# EAGLE schematic design_main (EAGLE 9.6.2), part 1 of 2

## Sheet 1 of 4
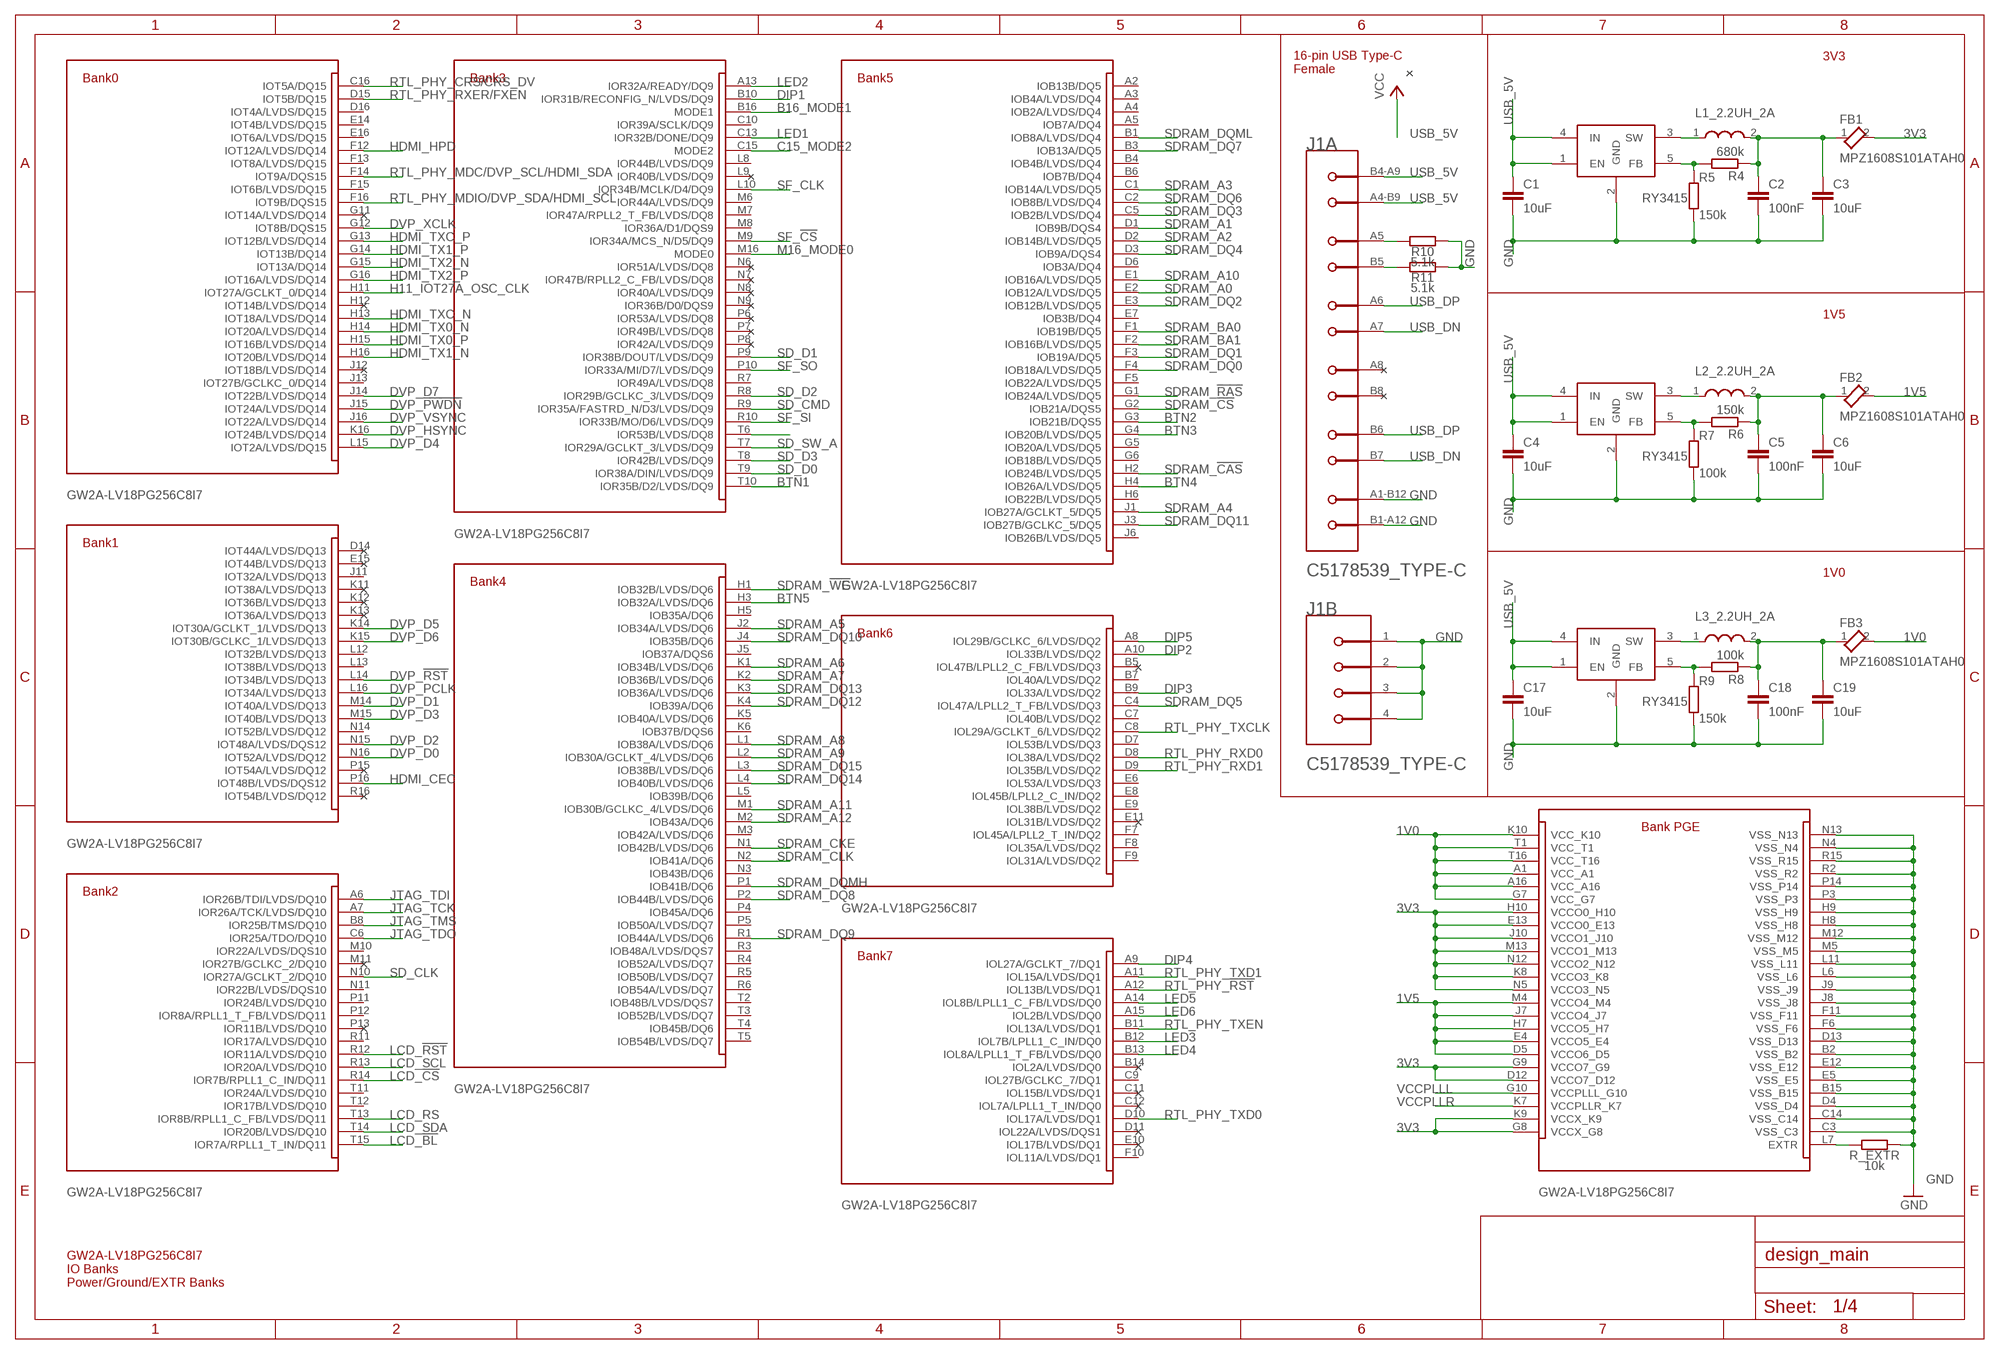
[diagram p0: schematic, sheet 1]

### Parts
C1  10uF  C-EUC0805  [C0805]
C2  100nF  C-EUC0805  [C0805]
C3  10uF  C-EUC0805  [C0805]
C4  10uF  C-EUC0805  [C0805]
C5  100nF  C-EUC0805  [C0805]
C6  10uF  C-EUC0805  [C0805]
C17  10uF  C-EUC0805  [C0805]
C18  100nF  C-EUC0805  [C0805]
C19  10uF  C-EUC0805  [C0805]
FB1  TDK_MPZ1608S101ATAH0TDK_MPZ1608S101ATAH0_0_0  [TDK_MPZ1608S101ATAH0_0]
FB2  TDK_MPZ1608S101ATAH0TDK_MPZ1608S101ATAH0_0_0  [TDK_MPZ1608S101ATAH0_0]
FB3  TDK_MPZ1608S101ATAH0TDK_MPZ1608S101ATAH0_0_0  [TDK_MPZ1608S101ATAH0_0]
J1  C5178539_TYPE-CMOLEX_217179-0001_0_0  [C5178539_TYPE-C]
L1_2.2UH_2A  L_0805TDK_MLZ2012N6R8LT000_0_0  [TDK_MLZ2012N6R8LT000_0]
L2_2.2UH_2A  2.2uH 2A  L_0805TDK_MLZ2012N6R8LT000_0_0  [TDK_MLZ2012N6R8LT000_0]
L3_2.2UH_2A  2.2uH 2A  L_0805TDK_MLZ2012N6R8LT000_0_0  [TDK_MLZ2012N6R8LT000_0]
R4  680k  R-EU_R0805  [R0805]
R5  150k  R-EU_R0805  [R0805]
R6  150k  R-EU_R0805  [R0805]
R7  100k  R-EU_R0805  [R0805]
R8  100k  R-EU_R0805  [R0805]
R9  150k  R-EU_R0805  [R0805]
R10  5.1k  R-EU_R0805  [R0805]
R11  5.1k  R-EU_R0805  [R0805]
R_EXTR  10k  R-EU_R0805  [R0805]
U$1  GW2A-LV18PG256C8I7  [BGA256C100P16X16_1700X1700X155]
U$3  RY3415  [RY3415]
U$4  RY3415  [RY3415]
U$5  RY3415  [RY3415]

### Nets
1V0: FB3.2 U$1.A1(VCC_A1) U$1.A16(VCC_A16) U$1.G7(VCC_G7) U$1.K10(VCC_K10) U$1.T1(VCC_T1) U$1.T16(VCC_T16) ; also sheet 2,4
1V5: FB2.2 U$1.D5(VCCO6_D5) U$1.E4(VCCO5_E4) U$1.H7(VCCO5_H7) U$1.J7(VCCO4_J7) U$1.M4(VCCO4_M4) ; also sheet 2,4
3V3: FB1.2 U$1.D12(VCCO7_D12) U$1.E13(VCCO0_E13) U$1.G8(VCCX_G8) U$1.G9(VCCO7_G9) U$1.H10(VCCO0_H10) U$1.J10(VCCO1_J10) U$1.K8(VCCO3_K8) U$1.K9(VCCX_K9) U$1.M13(VCCO1_M13) U$1.N5(VCCO3_N5) U$1.N12(VCCO2_N12) ; also sheet 2,3,4
B16_MODE1: U$1.B16(MODE1) ; also sheet 2
BTN1: U$1.T10(IOR35B/D2/LVDS/DQ9) ; also sheet 2
BTN2: U$1.G3(IOB21B/DQS5) ; also sheet 2
BTN3: U$1.G4(IOB20B/LVDS/DQ5) ; also sheet 2
BTN4: U$1.H4(IOB26A/LVDS/DQ5) ; also sheet 2
BTN5: U$1.H3(IOB32A/LVDS/DQ6) ; also sheet 2
C15_MODE2: U$1.C15(MODE2) ; also sheet 2
DIP1: U$1.B10(IOR31B/RECONFIG_N/LVDS/DQ9) ; also sheet 2
DIP2: U$1.A10(IOL33B/LVDS/DQ2) ; also sheet 2
DIP3: U$1.B9(IOL33A/LVDS/DQ2) ; also sheet 2
DIP4: U$1.A9(IOL27A/GCLKT_7/DQ1) ; also sheet 2
DIP5: U$1.A8(IOL29B/GCLKC_6/LVDS/DQ2) ; also sheet 2
DVP_!PWDN!: U$1.J15(IOT24A/LVDS/DQ14) ; also sheet 4
DVP_!RST!: U$1.L14(IOT34B/LVDS/DQ13) ; also sheet 4
DVP_D0: U$1.N16(IOT52A/LVDS/DQ12) ; also sheet 4
DVP_D1: U$1.M14(IOT40A/LVDS/DQ13) ; also sheet 4
DVP_D2: U$1.N15(IOT48A/LVDS/DQS12) ; also sheet 4
DVP_D3: U$1.M15(IOT40B/LVDS/DQ13) ; also sheet 4
DVP_D4: U$1.L15(IOT2A/LVDS/DQ15) ; also sheet 4
DVP_D5: U$1.K14(IOT30A/GCLKT_1/LVDS/DQ13) ; also sheet 4
DVP_D6: U$1.K15(IOT30B/GCLKC_1/LVDS/DQ13) ; also sheet 4
DVP_D7: U$1.J14(IOT22B/LVDS/DQ14) ; also sheet 4
DVP_HSYNC: U$1.K16(IOT24B/LVDS/DQ14) ; also sheet 4
DVP_PCLK: U$1.L16(IOT34A/LVDS/DQ13) ; also sheet 4
DVP_VSYNC: U$1.J16(IOT22A/LVDS/DQ14) ; also sheet 4
DVP_XCLK: U$1.G12(IOT8B/DQS15) ; also sheet 4
GND: C1.1 C2.1 C3.1 C4.1 C5.1 C6.1 C17.1 C18.1 C19.1 J1.1(B:MNT_1) J1.2(B:MNT_2) J1.3(B:MNT_3) J1.4(B:MNT_4) J1.A1-B12(A:1_GND) J1.B1-A12(A:2_GND) R5.2 R7.2 R9.2 R10.1 R11.1 R_EXTR.2 U$1.B2(VSS_B2) U$1.B15(VSS_B15) U$1.C3(VSS_C3) U$1.C14(VSS_C14) U$1.D4(VSS_D4) U$1.D13(VSS_D13) U$1.E5(VSS_E5) U$1.E12(VSS_E12) U$1.F6(VSS_F6) U$1.F11(VSS_F11) U$1.H8(VSS_H8) U$1.H9(VSS_H9) U$1.J8(VSS_J8) U$1.J9(VSS_J9) U$1.L6(VSS_L6) U$1.L11(VSS_L11) U$1.M5(VSS_M5) U$1.M12(VSS_M12) U$1.N4(VSS_N4) U$1.N13(VSS_N13) U$1.P3(VSS_P3) U$1.P14(VSS_P14) U$1.R2(VSS_R2) U$1.R15(VSS_R15) U$3.2(GND) U$4.2(GND) U$5.2(GND) ; also sheet 2,3,4
H11_IOT27A_OSC_CLK: U$1.H11(IOT27A/GCLKT_0/DQ14) ; also sheet 2
HDMI_CEC: U$1.P16(IOT48B/LVDS/DQS12) ; also sheet 4
HDMI_HPD: U$1.F12(IOT12A/LVDS/DQ14) ; also sheet 4
HDMI_TX0_N: U$1.H14(IOT20A/LVDS/DQ14) ; also sheet 4
HDMI_TX0_P: U$1.H15(IOT16B/LVDS/DQ14) ; also sheet 4
HDMI_TX1_N: U$1.H16(IOT20B/LVDS/DQ14) ; also sheet 4
HDMI_TX1_P: U$1.G14(IOT13B/DQ14) ; also sheet 4
HDMI_TX2_N: U$1.G15(IOT13A/DQ14) ; also sheet 4
HDMI_TX2_P: U$1.G16(IOT16A/LVDS/DQ14) ; also sheet 4
HDMI_TXC_N: U$1.H13(IOT18A/LVDS/DQ14) ; also sheet 4
HDMI_TXC_P: U$1.G13(IOT12B/LVDS/DQ14) ; also sheet 4
JTAG_TCK: U$1.A7(IOR26A/TCK/LVDS/DQ10) ; also sheet 2,4
JTAG_TDI: U$1.A6(IOR26B/TDI/LVDS/DQ10) ; also sheet 2,4
JTAG_TDO: U$1.C6(IOR25A/TDO/DQ10) ; also sheet 2,4
JTAG_TMS: U$1.B8(IOR25B/TMS/DQ10) ; also sheet 2,4
LCD_!BL!: U$1.T15(IOR7A/RPLL1_T_IN/DQ11) ; also sheet 3
LCD_!CS!: U$1.R14(IOR7B/RPLL1_C_IN/DQ11) ; also sheet 3
LCD_!RST!: U$1.R12(IOR11A/LVDS/DQ10) ; also sheet 3
LCD_RS: U$1.T13(IOR8B/RPLL1_C_FB/LVDS/DQ11) ; also sheet 3
LCD_SCL: U$1.R13(IOR20A/LVDS/DQ10) ; also sheet 3
LCD_SDA: U$1.T14(IOR20B/LVDS/DQ10) ; also sheet 3
LED1: U$1.C13(IOR32B/DONE/DQ9) ; also sheet 2
LED2: U$1.A13(IOR32A/READY/DQ9) ; also sheet 2
LED3: U$1.B12(IOL7B/LPLL1_C_IN/DQ0) ; also sheet 2
LED4: U$1.B13(IOL8A/LPLL1_T_FB/LVDS/DQ0) ; also sheet 2
LED5: U$1.A14(IOL8B/LPLL1_C_FB/LVDS/DQ0) ; also sheet 2
LED6: U$1.A15(IOL2B/LVDS/DQ0) ; also sheet 2
M16_MODE0: U$1.M16(MODE0) ; also sheet 2
N$1: R6.2 R7.1 U$4.5(FB)
N$2: R_EXTR.1 U$1.L7(EXTR)
N$4: U$1.T6(IOR53B/LVDS/DQ8)
N$5: L2_2.2UH_2A.1 U$4.3(SW)
N$42: C5.2 C6.2 FB2.1 L2_2.2UH_2A.2 R6.1
N$43: R4.2 R5.1 U$3.5(FB)
N$44: L1_2.2UH_2A.1 U$3.3(SW)
N$45: C2.2 C3.2 FB1.1 L1_2.2UH_2A.2 R4.1
N$46: R8.2 R9.1 U$5.5(FB)
N$47: L3_2.2UH_2A.1 U$5.3(SW)
N$48: C18.2 C19.2 FB3.1 L3_2.2UH_2A.2 R8.1
N$49: J1.A5(A:CC1) R10.2
N$50: J1.B5(A:CC2) R11.2
RTL_PHY_!RST!: U$1.A12(IOL13B/LVDS/DQ1) ; also sheet 3
RTL_PHY_CRS/CRS_DV: U$1.C16(IOT5A/DQ15) ; also sheet 3
RTL_PHY_MDC/DVP_SCL/HDMI_SDA: U$1.F14(IOT9A/DQS15) ; also sheet 3,4
RTL_PHY_MDIO/DVP_SDA/HDMI_SCL: U$1.F16(IOT9B/DQS15) ; also sheet 3,4
RTL_PHY_RXD0: U$1.D8(IOL38A/LVDS/DQ2) ; also sheet 3
RTL_PHY_RXD1: U$1.D9(IOL35B/LVDS/DQ2) ; also sheet 3
RTL_PHY_RXER/FXEN: U$1.D15(IOT5B/DQ15) ; also sheet 3
RTL_PHY_TXCLK: U$1.C8(IOL29A/GCLKT_6/LVDS/DQ2) ; also sheet 3
RTL_PHY_TXD0: U$1.D10(IOL17A/LVDS/DQ1) ; also sheet 3
RTL_PHY_TXD1: U$1.A11(IOL15A/LVDS/DQ1) ; also sheet 3
RTL_PHY_TXEN: U$1.B11(IOL13A/LVDS/DQ1) ; also sheet 3
SD_CLK: U$1.N10(IOR27A/GCLKT_2/DQ10) ; also sheet 2
SD_CMD: U$1.R9(IOR35A/FASTRD_N/D3/LVDS/DQ9) ; also sheet 2
SD_D0: U$1.T9(IOR38A/DIN/LVDS/DQ9) ; also sheet 2
SD_D1: U$1.P9(IOR38B/DOUT/LVDS/DQ9) ; also sheet 2
SD_D2: U$1.R8(IOR29B/GCLKC_3/LVDS/DQ9) ; also sheet 2
SD_D3: U$1.T8(IOR42B/LVDS/DQ9) ; also sheet 2
SD_SW_A: U$1.T7(IOR29A/GCLKT_3/LVDS/DQ9) ; also sheet 2
SDRAM_!CAS!: U$1.H2(IOB24B/LVDS/DQ5) ; also sheet 3
SDRAM_!CS!: U$1.G2(IOB21A/DQS5) ; also sheet 3
SDRAM_!RAS!: U$1.G1(IOB24A/LVDS/DQ5) ; also sheet 3
SDRAM_!WE!: U$1.H1(IOB32B/LVDS/DQ6) ; also sheet 3
SDRAM_A0: U$1.E2(IOB12A/LVDS/DQ5) ; also sheet 3
SDRAM_A1: U$1.D1(IOB9B/DQS4) ; also sheet 3
SDRAM_A2: U$1.D2(IOB14B/LVDS/DQ5) ; also sheet 3
SDRAM_A3: U$1.C1(IOB14A/LVDS/DQ5) ; also sheet 3
SDRAM_A4: U$1.J1(IOB27A/GCLKT_5/DQ5) ; also sheet 3
SDRAM_A5: U$1.J2(IOB34A/LVDS/DQ6) ; also sheet 3
SDRAM_A6: U$1.K1(IOB34B/LVDS/DQ6) ; also sheet 3
SDRAM_A7: U$1.K2(IOB36B/LVDS/DQ6) ; also sheet 3
SDRAM_A8: U$1.L1(IOB38A/LVDS/DQ6) ; also sheet 3
SDRAM_A9: U$1.L2(IOB30A/GCLKT_4/LVDS/DQ6) ; also sheet 3
SDRAM_A10: U$1.E1(IOB16A/LVDS/DQ5) ; also sheet 3
SDRAM_A11: U$1.M1(IOB30B/GCLKC_4/LVDS/DQ6) ; also sheet 3
SDRAM_A12: U$1.M2(IOB43A/DQ6) ; also sheet 3
SDRAM_BA0: U$1.F1(IOB19B/DQ5) ; also sheet 3
SDRAM_BA1: U$1.F2(IOB16B/LVDS/DQ5) ; also sheet 3
SDRAM_CKE: U$1.N1(IOB42B/LVDS/DQ6) ; also sheet 3
SDRAM_CLK: U$1.N2(IOB41A/DQ6) ; also sheet 3
SDRAM_DQ0: U$1.F4(IOB18A/LVDS/DQ5) ; also sheet 3
SDRAM_DQ1: U$1.F3(IOB19A/DQ5) ; also sheet 3
SDRAM_DQ2: U$1.E3(IOB12B/LVDS/DQ5) ; also sheet 3
SDRAM_DQ3: U$1.C5(IOB2B/LVDS/DQ4) ; also sheet 3
SDRAM_DQ4: U$1.D3(IOB9A/DQS4) ; also sheet 3
SDRAM_DQ5: U$1.C4(IOL47A/LPLL2_T_FB/LVDS/DQ3) ; also sheet 3
SDRAM_DQ6: U$1.C2(IOB8B/LVDS/DQ4) ; also sheet 3
SDRAM_DQ7: U$1.B3(IOB13A/DQ5) ; also sheet 3
SDRAM_DQ8: U$1.P2(IOB44B/LVDS/DQ6) ; also sheet 3
SDRAM_DQ9: U$1.R1(IOB44A/LVDS/DQ6) ; also sheet 3
SDRAM_DQ10: U$1.J4(IOB35B/DQ6) ; also sheet 3
SDRAM_DQ11: U$1.J3(IOB27B/GCLKC_5/DQ5) ; also sheet 3
SDRAM_DQ12: U$1.K4(IOB39A/DQ6) ; also sheet 3
SDRAM_DQ13: U$1.K3(IOB36A/LVDS/DQ6) ; also sheet 3
SDRAM_DQ14: U$1.L4(IOB40B/LVDS/DQ6) ; also sheet 3
SDRAM_DQ15: U$1.L3(IOB38B/LVDS/DQ6) ; also sheet 3
SDRAM_DQMH: U$1.P1(IOB41B/DQ6) ; also sheet 3
SDRAM_DQML: U$1.B1(IOB8A/LVDS/DQ4) ; also sheet 3
SF_!CS!: U$1.M9(IOR34A/MCS_N/D5/DQ9) ; also sheet 3
SF_CLK: U$1.L10(IOR34B/MCLK/D4/DQ9) ; also sheet 3
SF_SI: U$1.R10(IOR33B/MO/D6/LVDS/DQ9) ; also sheet 3
SF_SO: U$1.P10(IOR33A/MI/D7/LVDS/DQ9) ; also sheet 3
USB_5V: C1.2 C4.2 C17.2 J1.A4-B9(A:1_VBUS) J1.B4-A9(A:2_VBUS) U$3.1(EN) U$3.4(IN) U$4.1(EN) U$4.4(IN) U$5.1(EN) U$5.4(IN) ; supply symbol labelled VCC ; also sheet 2,4
USB_DN: J1.A7(A:DN1) J1.B7(A:DN2) ; also sheet 2
USB_DP: J1.A6(A:DP1) J1.B6(A:DP2) ; also sheet 2
VCCPLLL: U$1.G10(VCCPLLL_G10) ; also sheet 2
VCCPLLR: U$1.K7(VCCPLLR_K7) ; also sheet 2
Unconnected: J1.A8(A:SBU1) J1.B8(A:SBU2) U$1.A2(IOB13B/DQ5) U$1.A3(IOB4A/LVDS/DQ4) U$1.A4(IOB2A/LVDS/DQ4) U$1.A5(IOB7A/DQ4) U$1.B4(IOB4B/LVDS/DQ4) U$1.B5(IOL47B/LPLL2_C_FB/LVDS/DQ3) U$1.B6(IOB7B/DQ4) U$1.B7(IOL40A/LVDS/DQ2) U$1.B14(IOL2A/LVDS/DQ0) U$1.C7(IOL40B/LVDS/DQ2) U$1.C9(IOL27B/GCLKC_7/DQ1) U$1.C10(IOR39A/SCLK/DQ9) U$1.C11(IOL15B/LVDS/DQ1) U$1.C12(IOL7A/LPLL1_T_IN/DQ0) U$1.D6(IOB3A/DQ4) U$1.D7(IOL53B/LVDS/DQ3) U$1.D11(IOL22A/LVDS/DQS1) U$1.D14(IOT44A/LVDS/DQ13) U$1.D16(IOT4A/LVDS/DQ15) U$1.E6(IOL53A/LVDS/DQ3) U$1.E7(IOB3B/DQ4) U$1.E8(IOL45B/LPLL2_C_IN/DQ2) U$1.E9(IOL38B/LVDS/DQ2) U$1.E10(IOL17B/LVDS/DQ1) U$1.E11(IOL31B/LVDS/DQ2) U$1.E14(IOT4B/LVDS/DQ15) U$1.E15(IOT44B/LVDS/DQ13) U$1.E16(IOT6A/LVDS/DQ15) U$1.F5(IOB22A/LVDS/DQ5) U$1.F7(IOL45A/LPLL2_T_IN/DQ2) U$1.F8(IOL35A/LVDS/DQ2) U$1.F9(IOL31A/LVDS/DQ2) U$1.F10(IOL11A/LVDS/DQ1) U$1.F13(IOT8A/LVDS/DQ15) U$1.F15(IOT6B/LVDS/DQ15) U$1.G5(IOB20A/LVDS/DQ5) U$1.G6(IOB18B/LVDS/DQ5) U$1.G11(IOT14A/LVDS/DQ14) U$1.H5(IOB35A/DQ6) U$1.H6(IOB22B/LVDS/DQ5) U$1.H12(IOT14B/LVDS/DQ14) U$1.J5(IOB37A/DQS6) U$1.J6(IOB26B/LVDS/DQ5) U$1.J11(IOT32A/LVDS/DQ13) U$1.J12(IOT18B/LVDS/DQ14) U$1.J13(IOT27B/GCLKC_0/DQ14) U$1.K5(IOB40A/LVDS/DQ6) U$1.K6(IOB37B/DQS6) U$1.K11(IOT38A/LVDS/DQ13) U$1.K12(IOT36B/LVDS/DQ13) U$1.K13(IOT36A/LVDS/DQ13) U$1.L5(IOB39B/DQ6) U$1.L8(IOR44B/LVDS/DQ9) U$1.L9(IOR40B/LVDS/DQ9) U$1.L12(IOT32B/LVDS/DQ13) U$1.L13(IOT38B/LVDS/DQ13) U$1.M3(IOB42A/LVDS/DQ6) U$1.M6(IOR44A/LVDS/DQ9) U$1.M7(IOR47A/RPLL2_T_FB/LVDS/DQ8) U$1.M8(IOR36A/D1/DQS9) U$1.M10(IOR22A/LVDS/DQS10) U$1.M11(IOR27B/GCLKC_2/DQ10) U$1.N3(IOB43B/DQ6) U$1.N6(IOR51A/LVDS/DQ8) U$1.N7(IOR47B/RPLL2_C_FB/LVDS/DQ8) U$1.N8(IOR40A/LVDS/DQ9) U$1.N9(IOR36B/D0/DQS9) U$1.N11(IOR22B/LVDS/DQS10) U$1.N14(IOT52B/LVDS/DQ12) U$1.P4(IOB45A/DQ6) U$1.P5(IOB50A/LVDS/DQ7) U$1.P6(IOR53A/LVDS/DQ8) U$1.P7(IOR49B/LVDS/DQ8) U$1.P8(IOR42A/LVDS/DQ9) U$1.P11(IOR24B/LVDS/DQ10) U$1.P12(IOR8A/RPLL1_T_FB/LVDS/DQ11) U$1.P13(IOR11B/LVDS/DQ10) U$1.P15(IOT54A/LVDS/DQ12) U$1.R3(IOB48A/LVDS/DQS7) U$1.R4(IOB52A/LVDS/DQ7) U$1.R5(IOB50B/LVDS/DQ7) U$1.R6(IOB54A/LVDS/DQ7) U$1.R7(IOR49A/LVDS/DQ8) U$1.R11(IOR17A/LVDS/DQ10) U$1.R16(IOT54B/LVDS/DQ12) U$1.T2(IOB48B/LVDS/DQS7) U$1.T3(IOB52B/LVDS/DQ7) U$1.T4(IOB45B/DQ6) U$1.T5(IOB54B/LVDS/DQ7) U$1.T11(IOR24A/LVDS/DQ10) U$1.T12(IOR17B/LVDS/DQ10)

### Notes on the sheet
- 3V3
- 16-pin USB Type-C
  Female
- 1V5
- 1V0
- GW2A-LV18PG256C8I7
  IO Banks
  Power/Ground/EXTR Banks

## Sheet 2 of 4
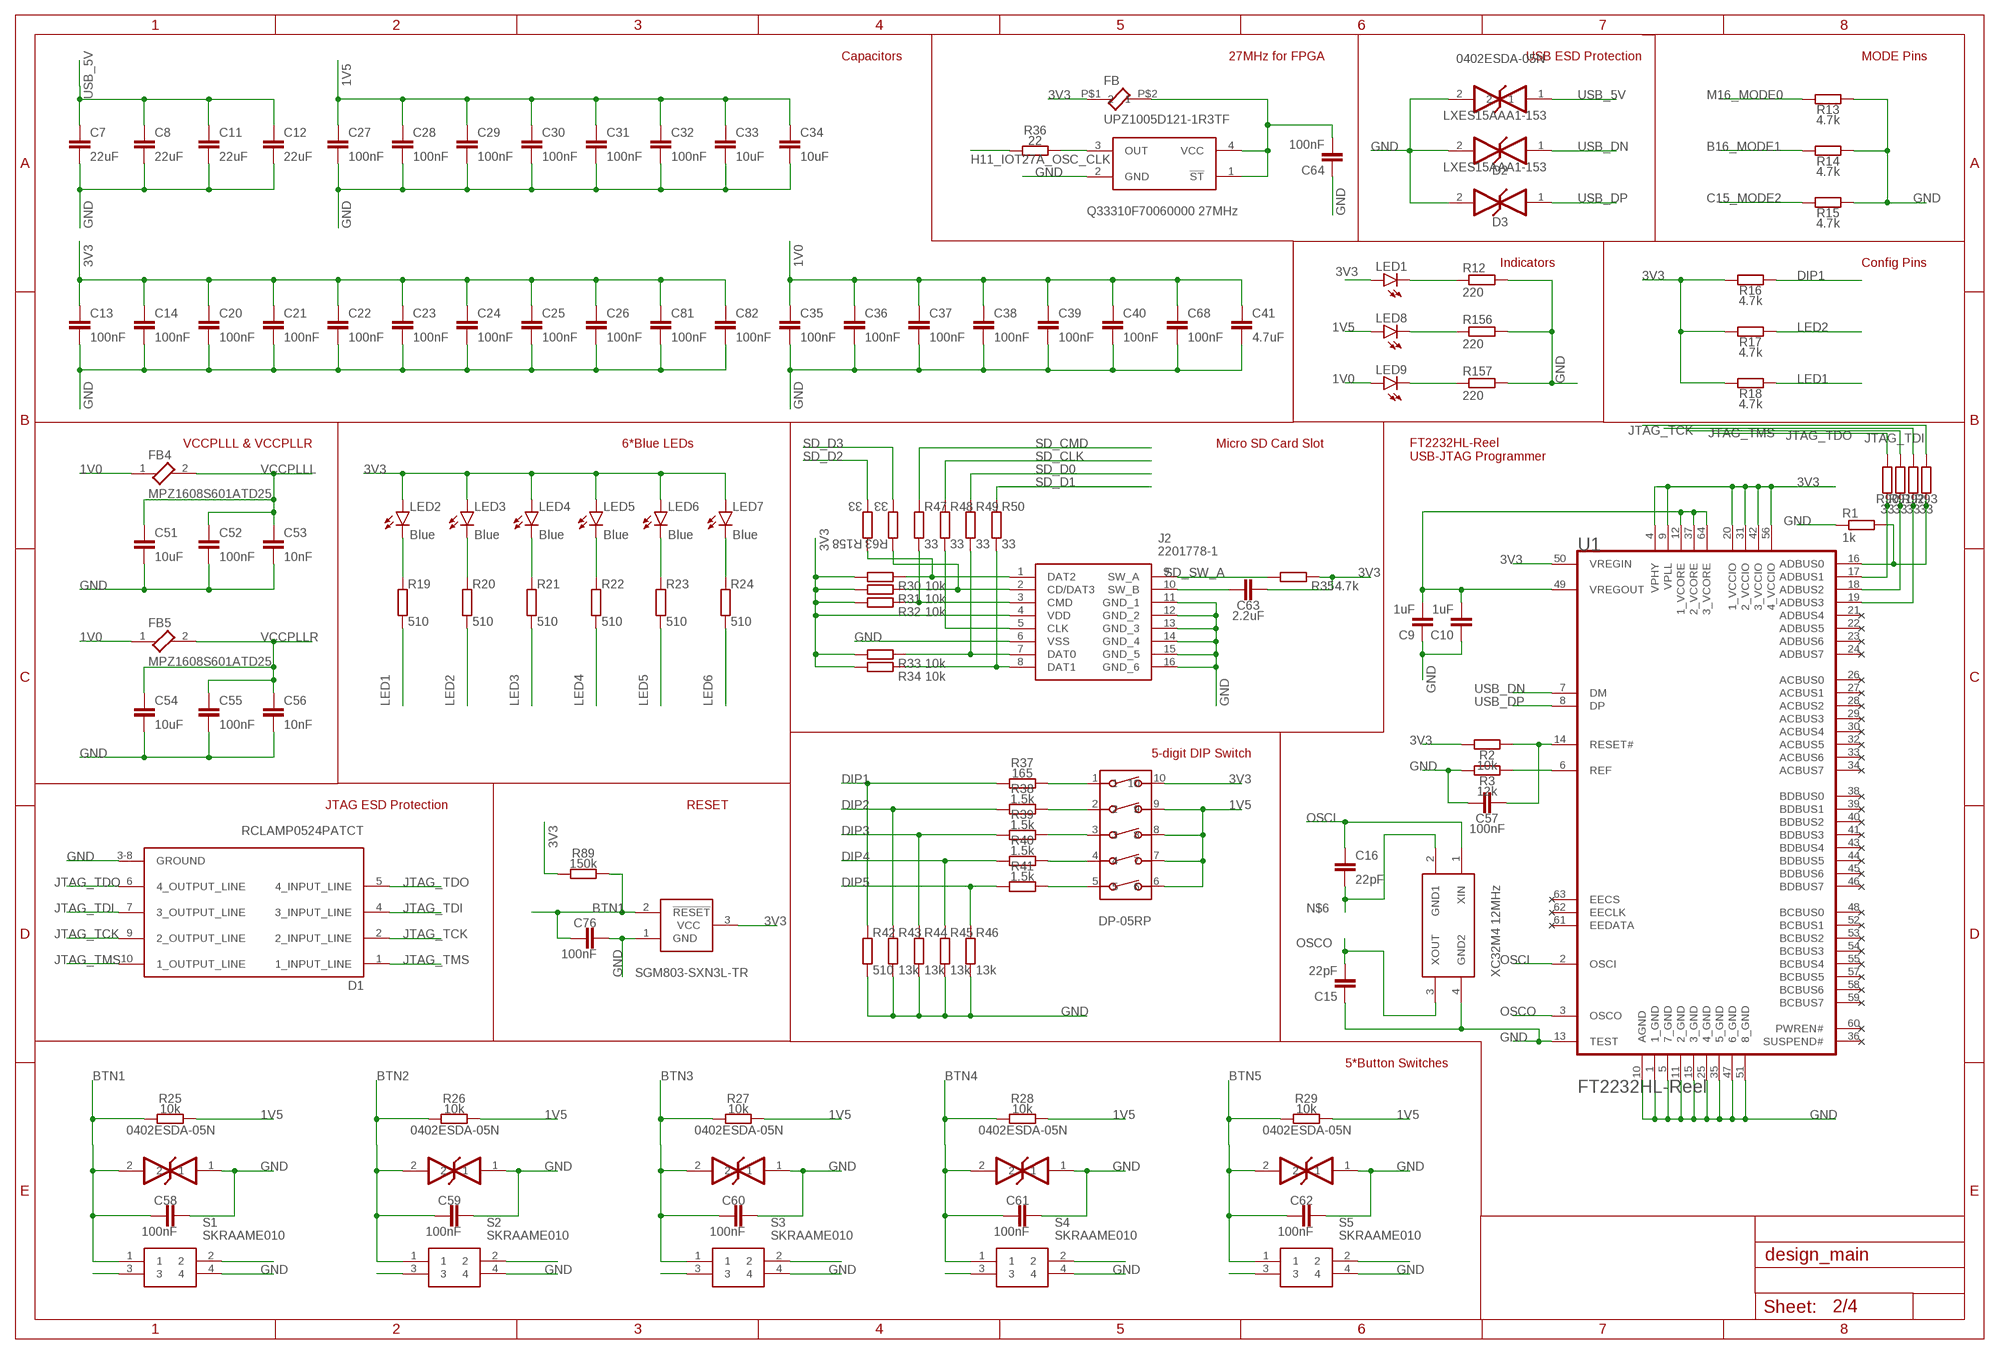
[diagram p1: schematic, sheet 2]

### Parts
C7  22uF  C-EUC0805  [C0805]
C8  22uF  C-EUC0805  [C0805]
C9  1uF  C-EUC0805  [C0805]
C10  1uF  C-EUC0805  [C0805]
C11  22uF  C-EUC0805  [C0805]
C12  22uF  C-EUC0805  [C0805]
C13  100nF  C-EUC0805  [C0805]
C14  100nF  C-EUC0805  [C0805]
C15  22pF  C-EUC0805  [C0805]
C16  22pF  C-EUC0805  [C0805]
C20  100nF  C-EUC0805  [C0805]
C21  100nF  C-EUC0805  [C0805]
C22  100nF  C-EUC0805  [C0805]
C23  100nF  C-EUC0805  [C0805]
C24  100nF  C-EUC0805  [C0805]
C25  100nF  C-EUC0805  [C0805]
C26  100nF  C-EUC0805  [C0805]
C27  100nF  C-EUC0805  [C0805]
C28  100nF  C-EUC0805  [C0805]
C29  100nF  C-EUC0805  [C0805]
C30  100nF  C-EUC0805  [C0805]
C31  100nF  C-EUC0805  [C0805]
C32  100nF  C-EUC0805  [C0805]
C33  10uF  C-EUC0805  [C0805]
C34  10uF  C-EUC0805  [C0805]
C35  100nF  C-EUC0805  [C0805]
C36  100nF  C-EUC0805  [C0805]
C37  100nF  C-EUC0805  [C0805]
C38  100nF  C-EUC0805  [C0805]
C39  100nF  C-EUC0805  [C0805]
C40  100nF  C-EUC0805  [C0805]
C41  4.7uF  C-EUC0805  [C0805]
C51  10uF  C-EUC0805  [C0805]
C52  100nF  C-EUC0805  [C0805]
C53  10nF  C-EUC0805  [C0805]
C54  10uF  C-EUC0805  [C0805]
C55  100nF  C-EUC0805  [C0805]
C56  10nF  C-EUC0805  [C0805]
C57  100nF  C-EUC0805  [C0805]
C58  100nF  C-EUC0805  [C0805]
C59  100nF  C-EUC0805  [C0805]
C60  100nF  C-EUC0805  [C0805]
C61  100nF  C-EUC0805  [C0805]
C62  100nF  C-EUC0805  [C0805]
C63  2.2uF  C-EUC0805  [C0805]
C64  100nF  C-EUC0805  [C0805]
C68  100nF  C-EUC0805  [C0805]
C76  100nF  C-EUC0805  [C0805]
C81  100nF  C-EUC0805  [C0805]
C82  100nF  C-EUC0805  [C0805]
D1  SEMTECH_RCLAMP0524PATCTSEMTECH_RCLAMP0524PATCT_0_0  [SEMTECH_RCLAMP0524PATCT_0]
D2  MURATA_LXES15AAA1-153MURATA_LXES15AAA1-153_0_0  [MURATA_LXES15AAA1-153_0]
D3  MURATA_LXES15AAA1-153MURATA_LXES15AAA1-153_0_0  [MURATA_LXES15AAA1-153_0]
FB  UPZ1005D121-1R3TF  [UPZ1005D121-1R3TF]
FB4  TDK_MPZ1608S601ATD25TDK_MPZ1608S601ATD25_0_0  [TDK_MPZ1608S601ATD25_0]
FB5  TDK_MPZ1608S601ATD25TDK_MPZ1608S601ATD25_0_0  [TDK_MPZ1608S601ATD25_0]
J2  2201778-1  [22017781]
LED1  LEDSML0805  [SML0805]
LED2  Blue  LEDSML0805  [SML0805]
LED3  Blue  LEDSML0805  [SML0805]
LED4  Blue  LEDSML0805  [SML0805]
LED5  Blue  LEDSML0805  [SML0805]
LED6  Blue  LEDSML0805  [SML0805]
LED7  Blue  LEDSML0805  [SML0805]
LED8  LEDSML0805  [SML0805]
LED9  LEDSML0805  [SML0805]
R1  1k  R-EU_R0805  [R0805]
R2  10k  R-EU_R0805  [R0805]
R3  12k  R-EU_R0805  [R0805]
R12  220  R-EU_R0805  [R0805]
R13  4.7k  R-EU_R0805  [R0805]
R14  4.7k  R-EU_R0805  [R0805]
R15  4.7k  R-EU_R0805  [R0805]
R16  4.7k  R-EU_R0805  [R0805]
R17  4.7k  R-EU_R0805  [R0805]
R18  4.7k  R-EU_R0805  [R0805]
R19  510  R-EU_R0805  [R0805]
R20  510  R-EU_R0805  [R0805]
R21  510  R-EU_R0805  [R0805]
R22  510  R-EU_R0805  [R0805]
R23  510  R-EU_R0805  [R0805]
R24  510  R-EU_R0805  [R0805]
R25  10k  R-EU_R0805  [R0805]
R26  10k  R-EU_R0805  [R0805]
R27  10k  R-EU_R0805  [R0805]
R28  10k  R-EU_R0805  [R0805]
R29  10k  R-EU_R0805  [R0805]
R30  10k  R-EU_R0805  [R0805]
R31  10k  R-EU_R0805  [R0805]
R32  10k  R-EU_R0805  [R0805]
R33  10k  R-EU_R0805  [R0805]
R34  10k  R-EU_R0805  [R0805]
R35  4.7k  R-EU_R0805  [R0805]
R36  22  R-EU_R0805  [R0805]
R37  165  R-EU_R0805  [R0805]
R38  1.5k  R-EU_R0805  [R0805]
R39  1.5k  R-EU_R0805  [R0805]
R40  1.5k  R-EU_R0805  [R0805]
R41  1.5k  R-EU_R0805  [R0805]
R42  510  R-EU_R0805  [R0805]
R43  13k  R-EU_R0805  [R0805]
R44  13k  R-EU_R0805  [R0805]
R45  13k  R-EU_R0805  [R0805]
R46  13k  R-EU_R0805  [R0805]
R47  33  R-EU_R0805  [R0805]
R48  33  R-EU_R0805  [R0805]
R49  33  R-EU_R0805  [R0805]
R50  33  R-EU_R0805  [R0805]
R63  33  R-EU_R0805  [R0805]
R89  150k  R-EU_R0805  [R0805]
R90  33  R-EU_R0805  [R0805]
R91  33  R-EU_R0805  [R0805]
R92  33  R-EU_R0805  [R0805]
R93  33  R-EU_R0805  [R0805]
R156  220  R-EU_R0805  [R0805]
R157  220  R-EU_R0805  [R0805]
R158  33  R-EU_R0805  [R0805]
S1  SKRAAME010  [SKRAAME010]
S2  SKRAAME010  [SKRAAME010]
S3  SKRAAME010  [SKRAAME010]
S4  SKRAAME010  [SKRAAME010]
S5  SKRAAME010  [SKRAAME010]
U1  FTDI_FT2232HL-REELFTDI_FT2232HL-REEL_0_0  [FTDI_FT2232HL-REEL_0]
U$2  XC32M4-12MHZ  [XC32M4-12MHZ]
U$6  0402ESDA-05N  [0402ESDA-05N]
U$7  0402ESDA-05N  [0402ESDA-05N]
U$8  0402ESDA-05N  [0402ESDA-05N]
U$9  0402ESDA-05N  [0402ESDA-05N]
U$10  0402ESDA-05N  [0402ESDA-05N]
U$11  0402ESDA-05N  [0402ESDA-05N]
U$13  DP-05RP  [DP-05RP]
U$15  Q33310F70060000-27MHZ  [Q33310F70060000-27MHZ]
U$16  SGM803-SXN3L-TR  [SGM803-SXN3L-TR]

### Nets
1V0: C35.2 C36.2 C37.2 C38.2 C39.2 C40.2 C41.2 C68.2 FB4.1 FB5.1 LED9.A ; also sheet 1,4
1V5: C27.2 C28.2 C29.2 C30.2 C31.2 C32.2 C33.2 C34.2 LED8.A R25.2 R26.2 R27.2 R28.2 R29.2 U$13.6 U$13.7 U$13.8 U$13.9 ; also sheet 1,4
3V3: C13.2 C14.2 C20.2 C21.2 C22.2 C23.2 C24.2 C25.2 C26.2 C63.1 C81.2 C82.2 FB.P$1 J2.4(VDD) LED1.A LED2.A LED3.A LED4.A LED5.A LED6.A LED7.A R2.1 R16.2 R17.2 R18.2 R30.1 R31.1 R32.1 R33.1 R34.1 R35.2 R89.1 U1.4(VPHY) U1.9(VPLL) U1.20(1_VCCIO) U1.31(2_VCCIO) U1.42(3_VCCIO) U1.50(VREGIN) U1.56(4_VCCIO) U$13.10 U$16.3(VCC) ; also sheet 1,3,4
B16_MODE1: R14.2 ; also sheet 1
BTN1: C58.2 C76.2 R25.1 R89.2 S1.1 U$7.2 U$16.2(!RESET!) ; also sheet 1
BTN2: C59.2 R26.1 S2.1 U$8.2 ; also sheet 1
BTN3: C60.2 R27.1 S3.1 U$9.2 ; also sheet 1
BTN4: C61.2 R28.1 S4.1 U$10.2 ; also sheet 1
BTN5: C62.2 R29.1 S5.1 U$11.2 ; also sheet 1
C15_MODE2: R15.2 ; also sheet 1
DIP1: R16.1 R37.1 R42.2 ; also sheet 1
DIP2: R38.1 R43.2 ; also sheet 1
DIP3: R39.1 R44.2 ; also sheet 1
DIP4: R40.1 R45.2 ; also sheet 1
DIP5: R41.1 R46.2 ; also sheet 1
GND: C7.1 C8.1 C9.1 C10.1 C11.1 C12.1 C13.1 C14.1 C15.1 C20.1 C21.1 C22.1 C23.1 C24.1 C25.1 C26.1 C27.1 C28.1 C29.1 C30.1 C31.1 C32.1 C33.1 C34.1 C35.1 C36.1 C37.1 C38.1 C39.1 C40.1 C41.1 C51.1 C52.1 C53.1 C54.1 C55.1 C56.1 C57.2 C58.1 C59.1 C60.1 C61.1 C62.1 C64.1 C68.1 C76.1 C81.1 C82.1 D1.3-8(GROUND) D2.2 D3.2 J2.6(VSS) J2.11(GND_1) J2.12(GND_2) J2.13(GND_3) J2.14(GND_4) J2.15(GND_5) J2.16(GND_6) R1.1 R3.1 R12.2 R13.1 R14.1 R15.1 R42.1 R43.1 R44.1 R45.1 R46.1 R156.2 R157.2 S1.4 S2.4 S3.4 S4.4 S5.4 U1.1(1_GND) U1.5(7_GND) U1.10(AGND) U1.11(2_GND) U1.13(TEST) U1.15(3_GND) U1.25(4_GND) U1.35(5_GND) U1.47(6_GND) U1.51(8_GND) U$2.4(GND2) U$6.2 U$7.1 U$8.1 U$9.1 U$10.1 U$11.1 U$15.2(GND) U$16.1(GND) ; also sheet 1,3,4
H11_IOT27A_OSC_CLK: R36.2 ; also sheet 1
JTAG_TCK: D1.2(2_INPUT_LINE) D1.9(2_OUTPUT_LINE) R93.1 ; also sheet 1,4
JTAG_TDI: D1.4(3_INPUT_LINE) D1.7(3_OUTPUT_LINE) R90.1 ; also sheet 1,4
JTAG_TDO: D1.5(4_INPUT_LINE) D1.6(4_OUTPUT_LINE) R91.1 ; also sheet 1,4
JTAG_TMS: D1.1(1_INPUT_LINE) D1.10(1_OUTPUT_LINE) R92.1 ; also sheet 1,4
LED1: R18.1 R19.2 ; also sheet 1
LED2: R17.1 R20.2 ; also sheet 1
LED3: R21.2 ; also sheet 1
LED4: R22.2 ; also sheet 1
LED5: R23.2 ; also sheet 1
LED6: R24.2 ; also sheet 1
M16_MODE0: R13.2 ; also sheet 1
N$3: R39.2 U$13.3
N$6: C16.1 U$2.2(GND1)
N$37: R3.2 U1.6(REF)
N$38: C57.1 R2.2 U1.14(RESET#)
N$39: C63.2 J2.10(SW_B)
N$41: J2.2(CD/DAT3) R31.2 R63.1
N$51: C9.2 C10.2 U1.12(1_VCORE) U1.37(2_VCORE) U1.49(VREGOUT) U1.64(3_VCORE)
N$52: LED1.C R12.1
N$56: J2.3(CMD) R32.2 R47.2
N$57: LED2.C R19.1
N$58: LED3.C R20.1
N$59: LED4.C R21.1
N$60: LED5.C R22.1
N$61: LED6.C R23.1
N$62: LED7.C R24.1
N$64: S1.3
N$65: S1.2
N$66: C64.2 FB.P$2 U$15.1(!ST!) U$15.4(VCC)
N$67: S2.3
N$68: S2.2
N$69: R36.1 U$15.3(OUT)
N$70: S3.3
N$71: S3.2
N$72: R37.2 U$13.1
N$73: S4.3
N$74: S4.2
N$75: R38.2 U$13.2
N$76: S5.3
N$77: S5.2
N$79: R40.2 U$13.4
N$80: R41.2 U$13.5
N$81: J2.5(CLK) R48.2
N$82: J2.7(DAT0) R33.2 R49.2
N$83: J2.8(DAT1) R34.2 R50.2
N$95: J2.1(DAT2) R30.2 R158.1
N$127: R1.2 R93.2 U1.16(ADBUS0)
N$128: R90.2 U1.17(ADBUS1)
N$129: R91.2 U1.18(ADBUS2)
N$130: R92.2 U1.19(ADBUS3)
N$183: LED8.C R156.1
N$189: LED9.C R157.1
OSCI: C16.2 U1.2(OSCI) U$2.1(XIN)
OSCO: C15.2 U1.3(OSCO) U$2.3(XOUT)
SD_CLK: R48.1 ; also sheet 1
SD_CMD: R47.1 ; also sheet 1
SD_D0: R49.1 ; also sheet 1
SD_D1: R50.1 ; also sheet 1
SD_D2: R158.2 ; also sheet 1
SD_D3: R63.2 ; also sheet 1
SD_SW_A: J2.9(SW_A) R35.1 ; also sheet 1
USB_5V: C7.2 C8.2 C11.2 C12.2 U$6.1 ; also sheet 1,4
USB_DN: D2.1 U1.7(DM) ; also sheet 1
USB_DP: D3.1 U1.8(DP) ; also sheet 1
VCCPLLL: C51.2 C52.2 C53.2 FB4.2 ; also sheet 1
VCCPLLR: C54.2 C55.2 C56.2 FB5.2 ; also sheet 1
Unconnected: U1.21(ADBUS4) U1.22(ADBUS5) U1.23(ADBUS6) U1.24(ADBUS7) U1.26(ACBUS0) U1.27(ACBUS1) U1.28(ACBUS2) U1.29(ACBUS3) U1.30(ACBUS4) U1.32(ACBUS5) U1.33(ACBUS6) U1.34(ACBUS7) U1.36(SUSPEND#) U1.38(BDBUS0) U1.39(BDBUS1) U1.40(BDBUS2) U1.41(BDBUS3) U1.43(BDBUS4) U1.44(BDBUS5) U1.45(BDBUS6) U1.46(BDBUS7) U1.48(BCBUS0) U1.52(BCBUS1) U1.53(BCBUS2) U1.54(BCBUS3) U1.55(BCBUS4) U1.57(BCBUS5) U1.58(BCBUS6) U1.59(BCBUS7) U1.60(PWREN#) U1.61(EEDATA) U1.62(EECLK) U1.63(EECS)

### Notes on the sheet
- Capacitors | 27MHz for FPGA | USB ESD Protection | MODE Pins
- Indicators | Config Pins
- VCCPLLL & VCCPLLR | 6*Blue LEDs | Micro SD Card Slot
- FT2232HL-Reel 
  USB-JTAG Programmer
- 5-digit DIP Switch
- JTAG ESD Protection | RESET
- 5*Button Switches

## Sheet 3 of 4
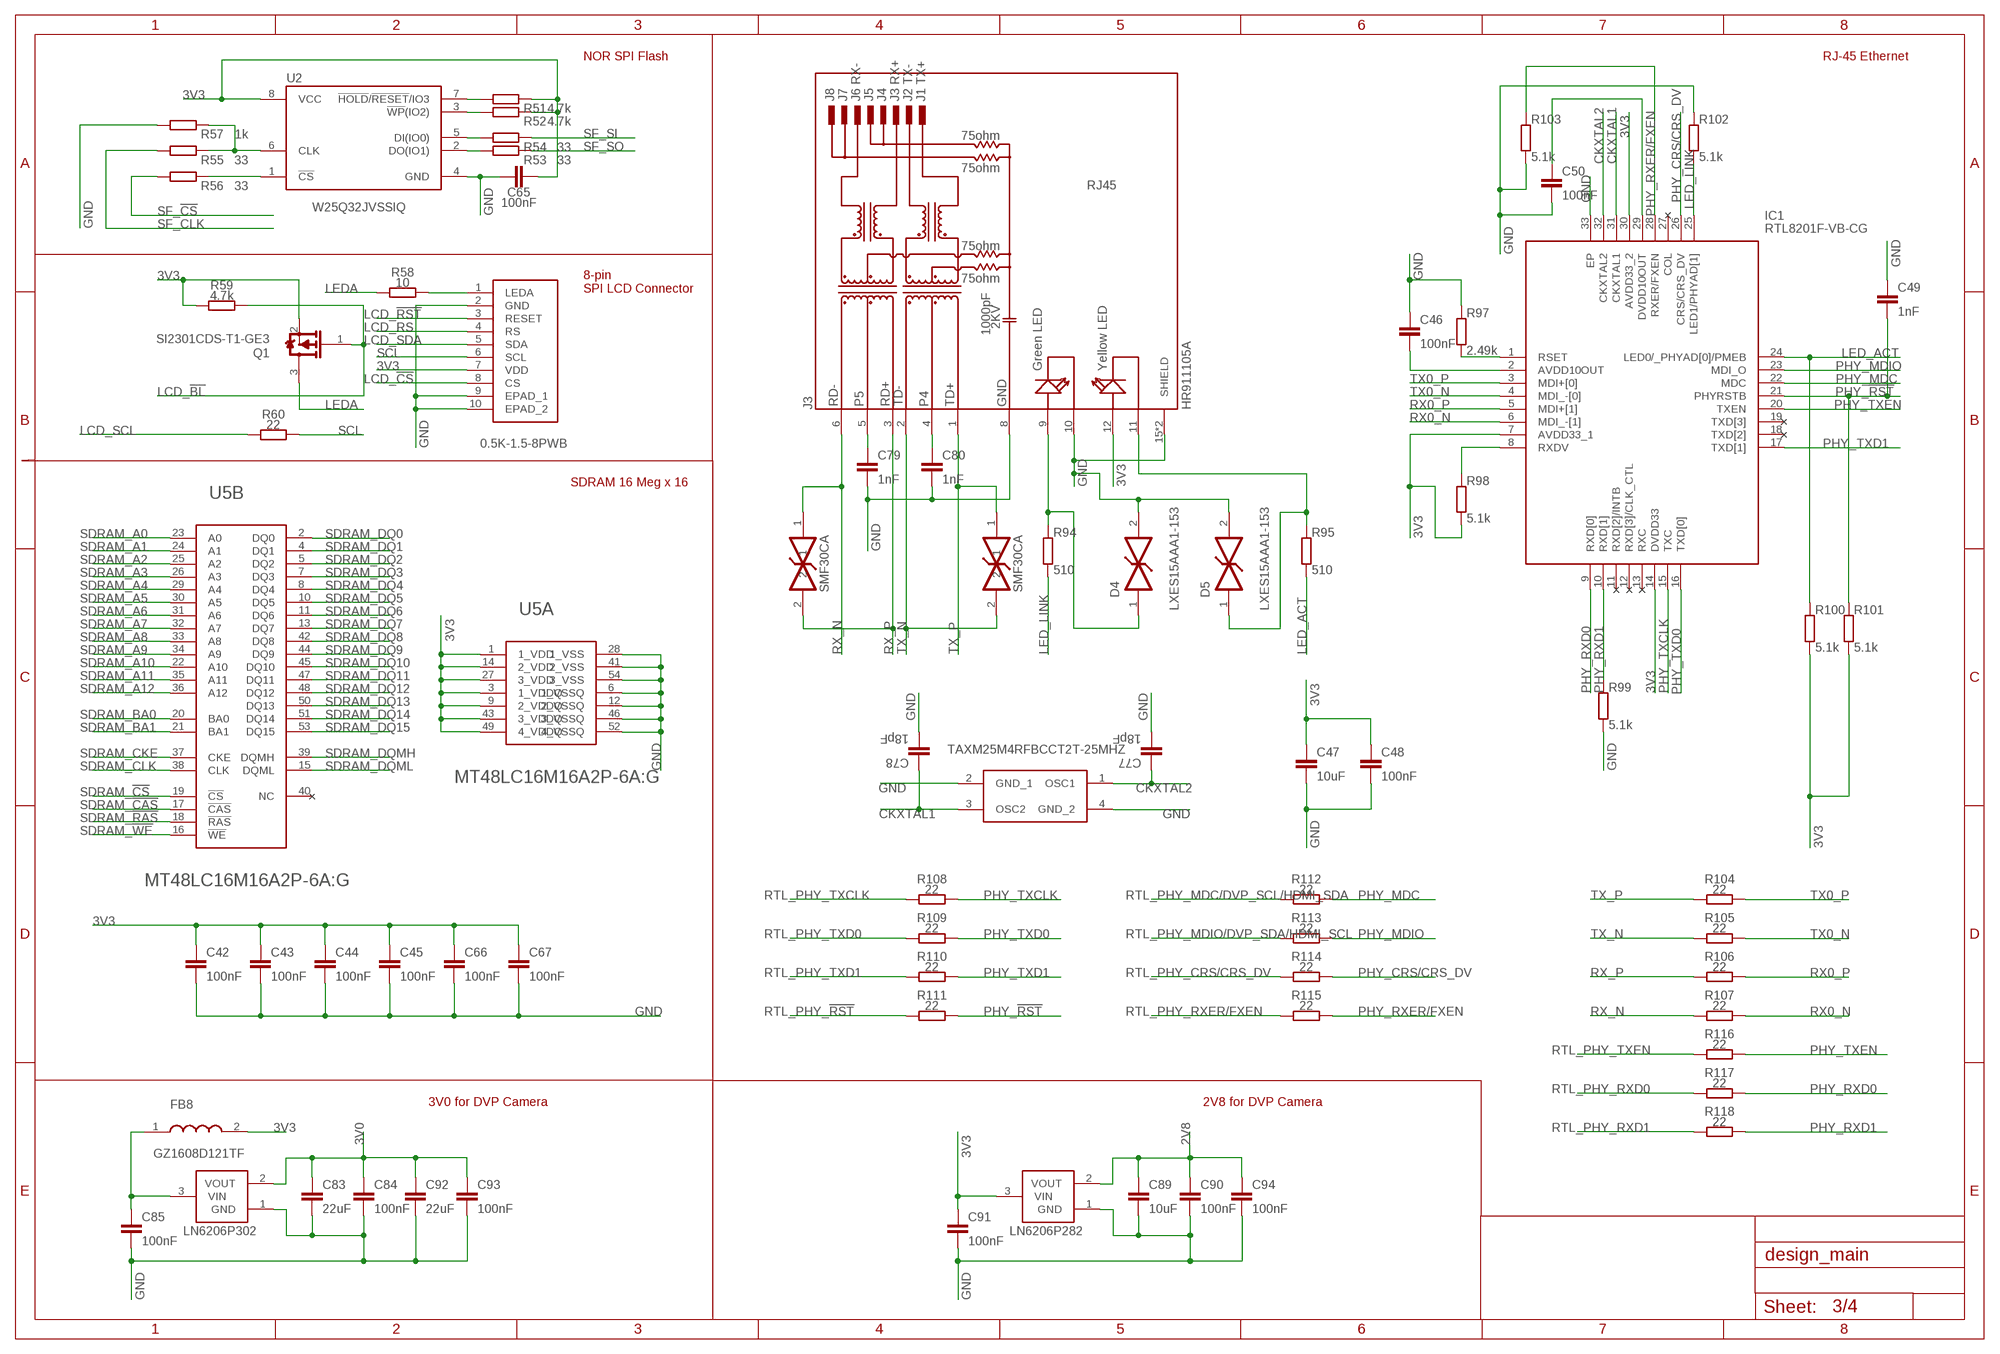
[diagram p2: schematic, sheet 3]

### Parts
C42  100nF  C-EUC0805  [C0805]
C43  100nF  C-EUC0805  [C0805]
C44  100nF  C-EUC0805  [C0805]
C45  100nF  C-EUC0805  [C0805]
C46  100nF  C-EUC0805  [C0805]
C47  10uF  C-EUC0805  [C0805]
C48  100nF  C-EUC0805  [C0805]
C49  1nF  C-EUC0805  [C0805]
C50  100nF  C-EUC0805  [C0805]
C65  100nF  C-EUC0805  [C0805]
C66  100nF  C-EUC0805  [C0805]
C67  100nF  C-EUC0805  [C0805]
C77  18pF  C-EUC0805  [C0805]
C78  18pF  C-EUC0805  [C0805]
C79  1nF  C-EUC0805  [C0805]
C80  1nF  C-EUC0805  [C0805]
C83  22uF  C-EUC0805  [C0805]
C84  100nF  C-EUC0805  [C0805]
C85  100nF  C-EUC0805  [C0805]
C89  10uF  C-EUC0805  [C0805]
C90  100nF  C-EUC0805  [C0805]
C91  100nF  C-EUC0805  [C0805]
C92  22uF  C-EUC0805  [C0805]
C93  100nF  C-EUC0805  [C0805]
C94  100nF  C-EUC0805  [C0805]
D4  MURATA_LXES15AAA1-153MURATA_LXES15AAA1-153_0_0  [MURATA_LXES15AAA1-153_0]
D5  MURATA_LXES15AAA1-153MURATA_LXES15AAA1-153_0_0  [MURATA_LXES15AAA1-153_0]
FB8  SUNLORD_GZ1608D121TFSUNLORD_GZ1608D121TF_0_0  [SUNLORD_GZ1608D121TF_0]
IC1  RTL8201F-VB-CG  [QFN50P500X500X100-33N]
J3  HR911105A  [HANRUN_HR911105A]
Q1  VISHAY_SI2301CDS-T1-GE3VISHAY_SI2301CDS-T1-GE3_0_0  [VISHAY_SI2301CDS-T1-GE3_0]
R51  4.7k  R-EU_R0805  [R0805]
R52  4.7k  R-EU_R0805  [R0805]
R53  33  R-EU_R0805  [R0805]
R54  33  R-EU_R0805  [R0805]
R55  33  R-EU_R0805  [R0805]
R56  33  R-EU_R0805  [R0805]
R57  1k  R-EU_R0805  [R0805]
R58  10  R-EU_R0805  [R0805]
R59  4.7k  R-EU_R0805  [R0805]
R60  22  R-EU_R0805  [R0805]
R94  510  R-EU_R0805  [R0805]
R95  510  R-EU_R0805  [R0805]
R97  2.49k  R-EU_R0805  [R0805]
R98  5.1k  R-EU_R0805  [R0805]
R99  5.1k  R-EU_R0805  [R0805]
R100  5.1k  R-EU_R0805  [R0805]
R101  5.1k  R-EU_R0805  [R0805]
R102  5.1k  R-EU_R0805  [R0805]
R103  5.1k  R-EU_R0805  [R0805]
R104  22  R-EU_R0805  [R0805]
R105  22  R-EU_R0805  [R0805]
R106  22  R-EU_R0805  [R0805]
R107  22  R-EU_R0805  [R0805]
R108  22  R-EU_R0805  [R0805]
R109  22  R-EU_R0805  [R0805]
R110  22  R-EU_R0805  [R0805]
R111  22  R-EU_R0805  [R0805]
R112  22  R-EU_R0805  [R0805]
R113  22  R-EU_R0805  [R0805]
R114  22  R-EU_R0805  [R0805]
R115  22  R-EU_R0805  [R0805]
R116  22  R-EU_R0805  [R0805]
R117  22  R-EU_R0805  [R0805]
R118  22  R-EU_R0805  [R0805]
U2  WINBOND_W25Q32JVSSIQWINBOND_W25Q32JVSSIQ_0_0  [WINBOND_W25Q32JVSSIQ_0]
U5  MICRON_MT48LC16M16A2P-6A-GMICRON_MT48LC16M16A2P-6A-G_0_0  [MICRON_MT48LC16M16A2P-6A-G_0]
U$14  0.5K-1.5-8PWB  [0.5K-1.5-8PWB]
U$17  TAXM25M4RFBCCT2T-25MHZ  [TAXM25M4RFBCCT2T-25MHZ]
U$18  SMF30CA  [SMF30CA]
U$19  SMF30CA  [SMF30CA]
U$20  LN6206P302  [LN6206P302]
U$22  LN6206P282  [LN6206P282]

### Nets
2V8: C89.2 C90.2 C94.2 U$22.2(VOUT) ; also sheet 4
3V0: C83.2 C84.2 C92.2 C93.2 U$20.2(VOUT) ; also sheet 4
3V3: C42.2 C43.2 C44.2 C45.2 C47.2 C48.2 C65.1 C66.2 C67.2 C91.2 FB8.2 IC1.7(AVDD33_1) IC1.14(DVDD33) IC1.30(AVDD33_2) J3.12(YA) Q1.2(S) R51.2 R52.2 R59.1 R98.1 R100.1 R101.1 U2.8(VCC) U5.1(A:1_VDD) U5.3(A:1_VDDQ) U5.9(A:2_VDDQ) U5.14(A:2_VDD) U5.27(A:3_VDD) U5.43(A:3_VDDQ) U5.49(A:4_VDDQ) U$14.7(VDD) U$22.3(VIN) ; also sheet 1,2,4
CKXTAL1: C78.2 IC1.31(CKXTAL1) U$17.3(OSC2)
CKXTAL2: C77.2 IC1.32(CKXTAL2) U$17.1(OSC1)
GND: C42.1 C43.1 C44.1 C45.1 C46.2 C47.1 C48.1 C49.2 C50.1 C65.2 C66.1 C67.1 C77.1 C78.1 C79.1 C80.1 C83.1 C84.1 C85.1 C89.1 C90.1 C91.1 C92.1 C93.1 C94.1 D4.2 D5.2 IC1.33(EP) J3.8(GND) J3.10(GC) J3.15(SHIELD) J3.16(SHIELD) R57.1 R97.1 R99.1 R102.1 R103.2 U2.4(GND) U5.6(A:1_VSSQ) U5.12(A:2_VSSQ) U5.28(A:1_VSS) U5.41(A:2_VSS) U5.46(A:3_VSSQ) U5.52(A:4_VSSQ) U5.54(A:3_VSS) U$14.2(GND) U$14.9(EPAD_1) U$14.10(EPAD_2) U$17.2(GND_1) U$17.4(GND_2) U$20.1(GND) U$22.1(GND) ; also sheet 1,2,4
LCD_!BL!: Q1.1(G) R59.2 ; also sheet 1
LCD_!CS!: U$14.8(CS) ; also sheet 1
LCD_!RST!: U$14.3(RESET) ; also sheet 1
LCD_RS: U$14.4(RS) ; also sheet 1
LCD_SCL: R60.1 ; also sheet 1
LCD_SDA: U$14.5(SDA) ; also sheet 1
LED_ACT: IC1.24(LED0/_PHYAD[0]/PMEB) R95.2 R100.2
LED_LINK: IC1.25(LED1/PHYAD[1]) R94.2 R102.2
LEDA: Q1.3(D) R58.1
N$84: R52.1 U2.3(!WP!(IO2))
N$86: R58.2 U$14.1(LEDA)
N$88: R51.1 U2.7(!HOLD!/!RESET!/IO3)
N$90: R53.1 U2.2(DO(IO1))
N$91: R54.1 U2.5(DI(IO0))
N$92: R55.2 R57.2 U2.6(CLK)
N$93: R56.2 U2.1(!CS!)
N$98: IC1.1(RSET) R97.2
N$101: C46.1 IC1.2(AVDD10OUT)
N$131: C79.2 J3.5
N$132: C80.2 J3.4
N$133: D4.1 J3.9(GA) R94.1
N$134: D5.1 J3.11(YC) R95.1
N$135: IC1.8(RXDV) R98.2
N$142: C50.2 IC1.29(DVDD10OUT)
N$145: C85.2 FB8.1 U$20.3(VIN)
PHY_!RST!: C49.1 IC1.21(PHYRSTB) R101.2 R111.2
PHY_CRS/CRS_DV: IC1.26(CRS/CRS_DV) R114.2
PHY_MDC: IC1.22(MDC) R112.2
PHY_MDIO: IC1.23(MDI_O) R113.2
PHY_RXD0: IC1.9(RXD[0]) R117.2
PHY_RXD1: IC1.10(RXD[1]) R99.2 R118.2
PHY_RXER/FXEN: IC1.28(RXER/FXEN) R103.1 R115.2
PHY_TXCLK: IC1.15(TXC) R108.2
PHY_TXD0: IC1.16(TXD[0]) R109.2
PHY_TXD1: IC1.17(TXD[1]) R110.2
PHY_TXEN: IC1.20(TXEN) R116.2
RTL_PHY_!RST!: R111.1 ; also sheet 1
RTL_PHY_CRS/CRS_DV: R114.1 ; also sheet 1
RTL_PHY_MDC/DVP_SCL/HDMI_SDA: R112.1 ; also sheet 1,4
RTL_PHY_MDIO/DVP_SDA/HDMI_SCL: R113.1 ; also sheet 1,4
RTL_PHY_RXD0: R117.1 ; also sheet 1
RTL_PHY_RXD1: R118.1 ; also sheet 1
RTL_PHY_RXER/FXEN: R115.1 ; also sheet 1
RTL_PHY_TXCLK: R108.1 ; also sheet 1
RTL_PHY_TXD0: R109.1 ; also sheet 1
RTL_PHY_TXD1: R110.1 ; also sheet 1
RTL_PHY_TXEN: R116.1 ; also sheet 1
RX0_N: IC1.6(MDI_-[1]) R107.2
RX0_P: IC1.5(MDI+[1]) R106.2
RX_N: J3.6(RD-) R107.1 U$18.1
RX_P: J3.3(RD+) R106.1 U$18.2
SCL: R60.2 U$14.6(SCL)
SDRAM_!CAS!: U5.17(B:!CAS!) ; also sheet 1
SDRAM_!CS!: U5.19(B:!CS!) ; also sheet 1
SDRAM_!RAS!: U5.18(B:!RAS!) ; also sheet 1
SDRAM_!WE!: U5.16(B:!WE!) ; also sheet 1
SDRAM_A0: U5.23(B:A0) ; also sheet 1
SDRAM_A1: U5.24(B:A1) ; also sheet 1
SDRAM_A2: U5.25(B:A2) ; also sheet 1
SDRAM_A3: U5.26(B:A3) ; also sheet 1
SDRAM_A4: U5.29(B:A4) ; also sheet 1
SDRAM_A5: U5.30(B:A5) ; also sheet 1
SDRAM_A6: U5.31(B:A6) ; also sheet 1
SDRAM_A7: U5.32(B:A7) ; also sheet 1
SDRAM_A8: U5.33(B:A8) ; also sheet 1
SDRAM_A9: U5.34(B:A9) ; also sheet 1
SDRAM_A10: U5.22(B:A10) ; also sheet 1
SDRAM_A11: U5.35(B:A11) ; also sheet 1
SDRAM_A12: U5.36(B:A12) ; also sheet 1
SDRAM_BA0: U5.20(B:BA0) ; also sheet 1
SDRAM_BA1: U5.21(B:BA1) ; also sheet 1
SDRAM_CKE: U5.37(B:CKE) ; also sheet 1
SDRAM_CLK: U5.38(B:CLK) ; also sheet 1
SDRAM_DQ0: U5.2(B:DQ0) ; also sheet 1
SDRAM_DQ1: U5.4(B:DQ1) ; also sheet 1
SDRAM_DQ2: U5.5(B:DQ2) ; also sheet 1
SDRAM_DQ3: U5.7(B:DQ3) ; also sheet 1
SDRAM_DQ4: U5.8(B:DQ4) ; also sheet 1
SDRAM_DQ5: U5.10(B:DQ5) ; also sheet 1
SDRAM_DQ6: U5.11(B:DQ6) ; also sheet 1
SDRAM_DQ7: U5.13(B:DQ7) ; also sheet 1
SDRAM_DQ8: U5.42(B:DQ8) ; also sheet 1
SDRAM_DQ9: U5.44(B:DQ9) ; also sheet 1
SDRAM_DQ10: U5.45(B:DQ10) ; also sheet 1
SDRAM_DQ11: U5.47(B:DQ11) ; also sheet 1
SDRAM_DQ12: U5.48(B:DQ12) ; also sheet 1
SDRAM_DQ13: U5.50(B:DQ13) ; also sheet 1
SDRAM_DQ14: U5.51(B:DQ14) ; also sheet 1
SDRAM_DQ15: U5.53(B:DQ15) ; also sheet 1
SDRAM_DQMH: U5.39(B:DQMH) ; also sheet 1
SDRAM_DQML: U5.15(B:DQML) ; also sheet 1
SF_!CS!: R56.1 ; also sheet 1
SF_CLK: R55.1 ; also sheet 1
SF_SI: R54.2 ; also sheet 1
SF_SO: R53.2 ; also sheet 1
TX0_N: IC1.4(MDI_-[0]) R105.2
TX0_P: IC1.3(MDI+[0]) R104.2
TX_N: J3.2(TD-) R105.1 U$19.2
TX_P: J3.1(TD+) R104.1 U$19.1
Unconnected: IC1.11(RXD[2]/INTB) IC1.12(RXD[3]/CLK_CTL) IC1.13(RXC) IC1.18(TXD[2]) IC1.19(TXD[3]) IC1.27(COL) U5.40(B:NC)

### Notes on the sheet
- NOR SPI Flash | RJ-45 Ethernet
- RJ45
- 8-pin
  SPI LCD Connector
- SDRAM 16 Meg x 16
- 3V0 for DVP Camera | 2V8 for DVP Camera

## Sheet 4 of 4
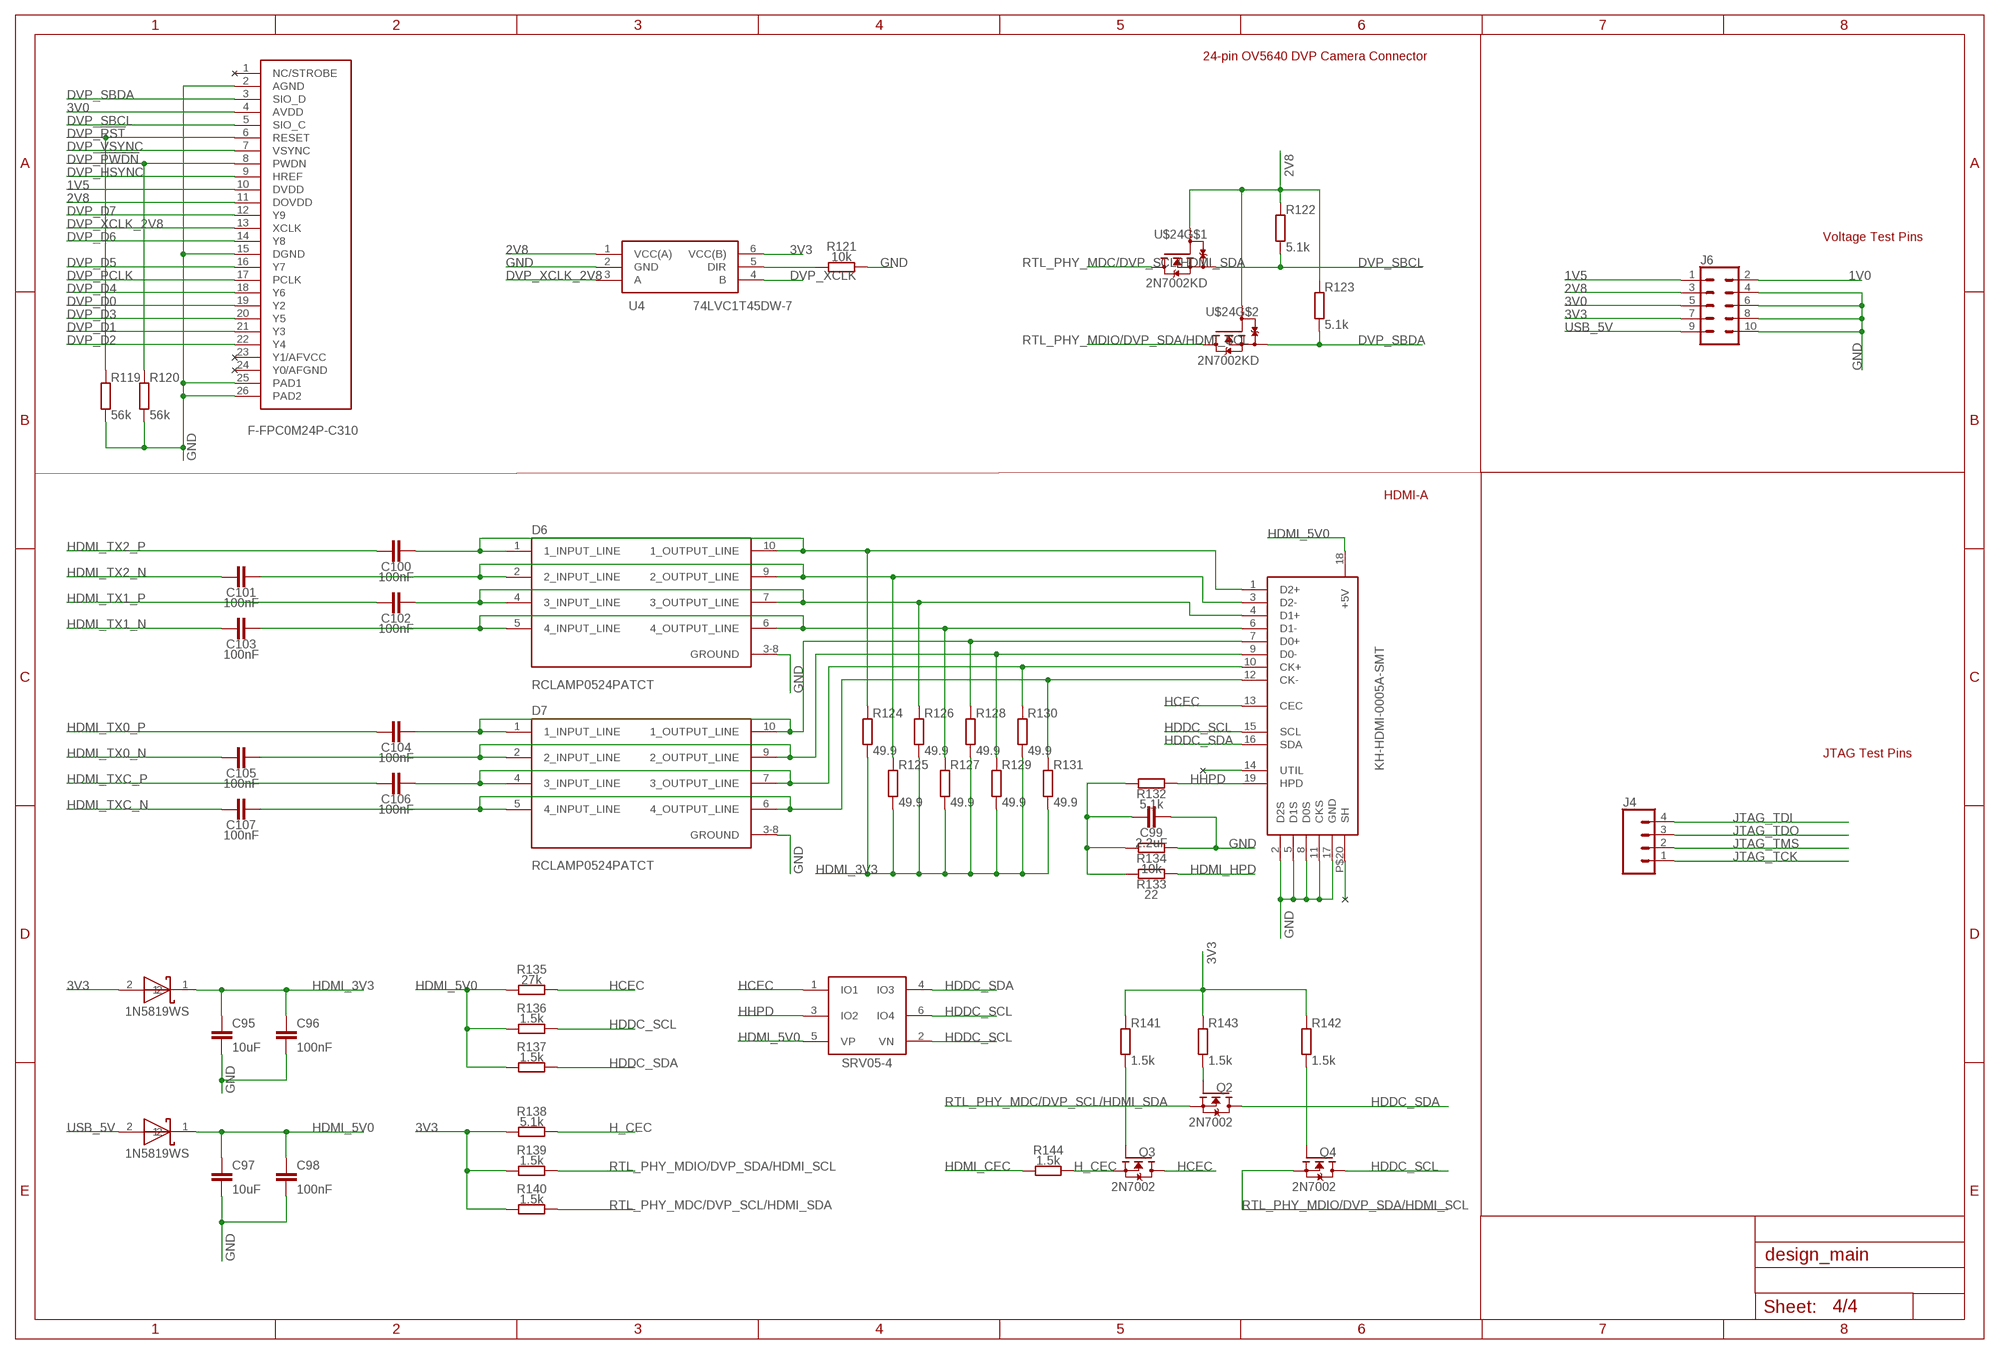
[diagram p3: schematic, sheet 4]

### Parts
C95  10uF  C-EUC0805  [C0805]
C96  100nF  C-EUC0805  [C0805]
C97  10uF  C-EUC0805  [C0805]
C98  100nF  C-EUC0805  [C0805]
C99  2.2uF  C-EUC0805  [C0805]
C100  100nF  C-EUC0805  [C0805]
C101  100nF  C-EUC0805  [C0805]
C102  100nF  C-EUC0805  [C0805]
C103  100nF  C-EUC0805  [C0805]
C104  100nF  C-EUC0805  [C0805]
C105  100nF  C-EUC0805  [C0805]
C106  100nF  C-EUC0805  [C0805]
C107  100nF  C-EUC0805  [C0805]
D6  SEMTECH_RCLAMP0524PATCTSEMTECH_RCLAMP0524PATCT_0_0  [SEMTECH_RCLAMP0524PATCT_0]
D7  SEMTECH_RCLAMP0524PATCTSEMTECH_RCLAMP0524PATCT_0_0  [SEMTECH_RCLAMP0524PATCT_0]
J4  CONN_04PTH  [1X04]
J6  CONN_05X2PTH  [2X5]
Q2  2N7002  [SOT95P240X111-3N]
Q3  2N7002  [SOT95P240X111-3N]
Q4  2N7002  [SOT95P240X111-3N]
R119  56k  R-EU_R0805  [R0805]
R120  56k  R-EU_R0805  [R0805]
R121  10k  R-EU_R0805  [R0805]
R122  5.1k  R-EU_R0805  [R0805]
R123  5.1k  R-EU_R0805  [R0805]
R124  49.9  R-EU_R0805  [R0805]
R125  49.9  R-EU_R0805  [R0805]
R126  49.9  R-EU_R0805  [R0805]
R127  49.9  R-EU_R0805  [R0805]
R128  49.9  R-EU_R0805  [R0805]
R129  49.9  R-EU_R0805  [R0805]
R130  49.9  R-EU_R0805  [R0805]
R131  49.9  R-EU_R0805  [R0805]
R132  5.1k  R-EU_R0805  [R0805]
R133  22  R-EU_R0805  [R0805]
R134  10k  R-EU_R0805  [R0805]
R135  27k  R-EU_R0805  [R0805]
R136  1.5k  R-EU_R0805  [R0805]
R137  1.5k  R-EU_R0805  [R0805]
R138  5.1k  R-EU_R0805  [R0805]
R139  1.5k  R-EU_R0805  [R0805]
R140  1.5k  R-EU_R0805  [R0805]
R141  1.5k  R-EU_R0805  [R0805]
R142  1.5k  R-EU_R0805  [R0805]
R143  1.5k  R-EU_R0805  [R0805]
R144  1.5k  R-EU_R0805  [R0805]
U4  74LVC1T45DW-7  [SOT65P210X110-6N]
U$23  F-FPC0M24P-C310  [F-FPC0M24P-C310]
U$24  2N7002KD  [2N7002KD]
U$25  1N5819WS  [1N5819WS]
U$26  1N5819WS  [1N5819WS]
U$27  KH-HDMI-0005A-SMT  [KH-HDMI-0005A-SMT]
U$28  SRV05-4  [SRV05-4]

### Nets
1V0: J6.2 ; also sheet 1,2
1V5: J6.1 U$23.10(DVDD) ; also sheet 1,2
2V8: J6.3 R122.2 R123.2 U4.1(VCC(A)) U$23.11(DOVDD) U$24.P$2(G1) U$24.P$5(G2) ; also sheet 3
3V0: J6.5 U$23.4(AVDD) ; also sheet 3
3V3: J6.7 R138.1 R139.1 R140.1 R141.1 R142.1 R143.1 U4.6(VCC(B)) U$25.2 ; also sheet 1,2,3
DVP_!PWDN!: R120.1 U$23.8(PWDN) ; also sheet 1
DVP_!RST!: R119.1 U$23.6(RESET) ; also sheet 1
DVP_D0: U$23.19(Y2) ; also sheet 1
DVP_D1: U$23.21(Y3) ; also sheet 1
DVP_D2: U$23.22(Y4) ; also sheet 1
DVP_D3: U$23.20(Y5) ; also sheet 1
DVP_D4: U$23.18(Y6) ; also sheet 1
DVP_D5: U$23.16(Y7) ; also sheet 1
DVP_D6: U$23.14(Y8) ; also sheet 1
DVP_D7: U$23.12(Y9) ; also sheet 1
DVP_HSYNC: U$23.9(HREF) ; also sheet 1
DVP_PCLK: U$23.17(PCLK) ; also sheet 1
DVP_SBCL: R122.1 U$23.5(SIO_C) U$24.P$1(S1)
DVP_SBDA: R123.1 U$23.3(SIO_D) U$24.P$4(S2)
DVP_VSYNC: U$23.7(VSYNC) ; also sheet 1
DVP_XCLK: U4.4(B) ; also sheet 1
DVP_XCLK_2V8: U4.3(A) U$23.13(XCLK)
GND: C95.1 C96.1 C97.1 C98.1 C99.1 D6.3-8(GROUND) D7.3-8(GROUND) J6.4 J6.6 J6.8 J6.10 R119.2 R120.2 R121.2 R134.2 U4.2(GND) U$23.2(AGND) U$23.15(DGND) U$23.25(PAD1) U$23.26(PAD2) U$27.2(D2S) U$27.5(D1S) U$27.8(D0S) U$27.11(CKS) U$27.17(GND) ; also sheet 1,2,3
H_CEC: Q3.2(S) R138.2 R144.2
HCEC: Q3.3(D) R135.2 U$27.13(CEC) U$28.1(IO1)
HDDC_SCL: Q4.3(D) R136.2 U$27.15(SCL) U$28.2(VN) U$28.6(IO4)
HDDC_SDA: Q2.3(D) R137.2 U$27.16(SDA) U$28.4(IO3)
HDMI_3V3: C95.2 C96.2 R124.2 R125.2 R126.2 R127.2 R128.2 R129.2 R130.2 R131.2 U$25.1
HDMI_5V0: C97.2 C98.2 R135.1 R136.1 R137.1 U$26.1 U$27.18(+5V) U$28.5(VP)
HDMI_CEC: R144.1 ; also sheet 1
HDMI_HPD: R133.2 ; also sheet 1
HDMI_TX0_N: C105.2 ; also sheet 1
HDMI_TX0_P: C104.2 ; also sheet 1
HDMI_TX1_N: C103.2 ; also sheet 1
HDMI_TX1_P: C102.2 ; also sheet 1
HDMI_TX2_N: C101.2 ; also sheet 1
HDMI_TX2_P: C100.2 ; also sheet 1
HDMI_TXC_N: C107.2 ; also sheet 1
HDMI_TXC_P: C106.2 ; also sheet 1
HHPD: R132.2 U$27.19(HPD) U$28.3(IO2)
JTAG_TCK: J4.1 ; also sheet 1,2
JTAG_TDI: J4.4 ; also sheet 1,2
JTAG_TDO: J4.3 ; also sheet 1,2
JTAG_TMS: J4.2 ; also sheet 1,2
N$40: U$27.P$20(SH)
N$141: R121.1 U4.5(DIR)
N$147: C100.1 D6.1(1_INPUT_LINE) D6.10(1_OUTPUT_LINE) R124.1 U$27.1(D2+)
N$148: C101.1 D6.2(2_INPUT_LINE) D6.9(2_OUTPUT_LINE) R125.1 U$27.3(D2-)
N$149: C102.1 D6.4(3_INPUT_LINE) D6.7(3_OUTPUT_LINE) R126.1 U$27.4(D1+)
N$150: C103.1 D6.5(4_INPUT_LINE) D6.6(4_OUTPUT_LINE) R127.1 U$27.6(D1-)
N$151: C104.1 D7.1(1_INPUT_LINE) D7.10(1_OUTPUT_LINE) R128.1 U$27.7(D0+)
N$152: C105.1 D7.2(2_INPUT_LINE) D7.9(2_OUTPUT_LINE) R129.1 U$27.9(D0-)
N$153: C106.1 D7.4(3_INPUT_LINE) D7.7(3_OUTPUT_LINE) R130.1 U$27.10(CK+)
N$154: C107.1 D7.5(4_INPUT_LINE) D7.6(4_OUTPUT_LINE) R131.1 U$27.12(CK-)
N$155: C99.2 R132.1 R133.1 R134.1
N$157: Q2.1(G) R143.2
N$158: U$27.14(UTIL)
N$162: Q3.1(G) R141.2
N$163: Q4.1(G) R142.2
RTL_PHY_MDC/DVP_SCL/HDMI_SDA: Q2.2(S) R140.2 U$24.P$6(D1) ; also sheet 1,3
RTL_PHY_MDIO/DVP_SDA/HDMI_SCL: Q4.2(S) R139.2 U$24.P$3(D2) ; also sheet 1,3
USB_5V: J6.9 U$26.2 ; also sheet 1,2
Unconnected: U$23.1(NC/STROBE) U$23.23(Y1/AFVCC) U$23.24(Y0/AFGND)

### Notes on the sheet
- 24-pin OV5640 DVP Camera Connector
- Voltage Test Pins
- HDMI-A
- JTAG Test Pins